# EAGLE design Easycheck_rev2_motherboard (EAGLE 9.4.0)
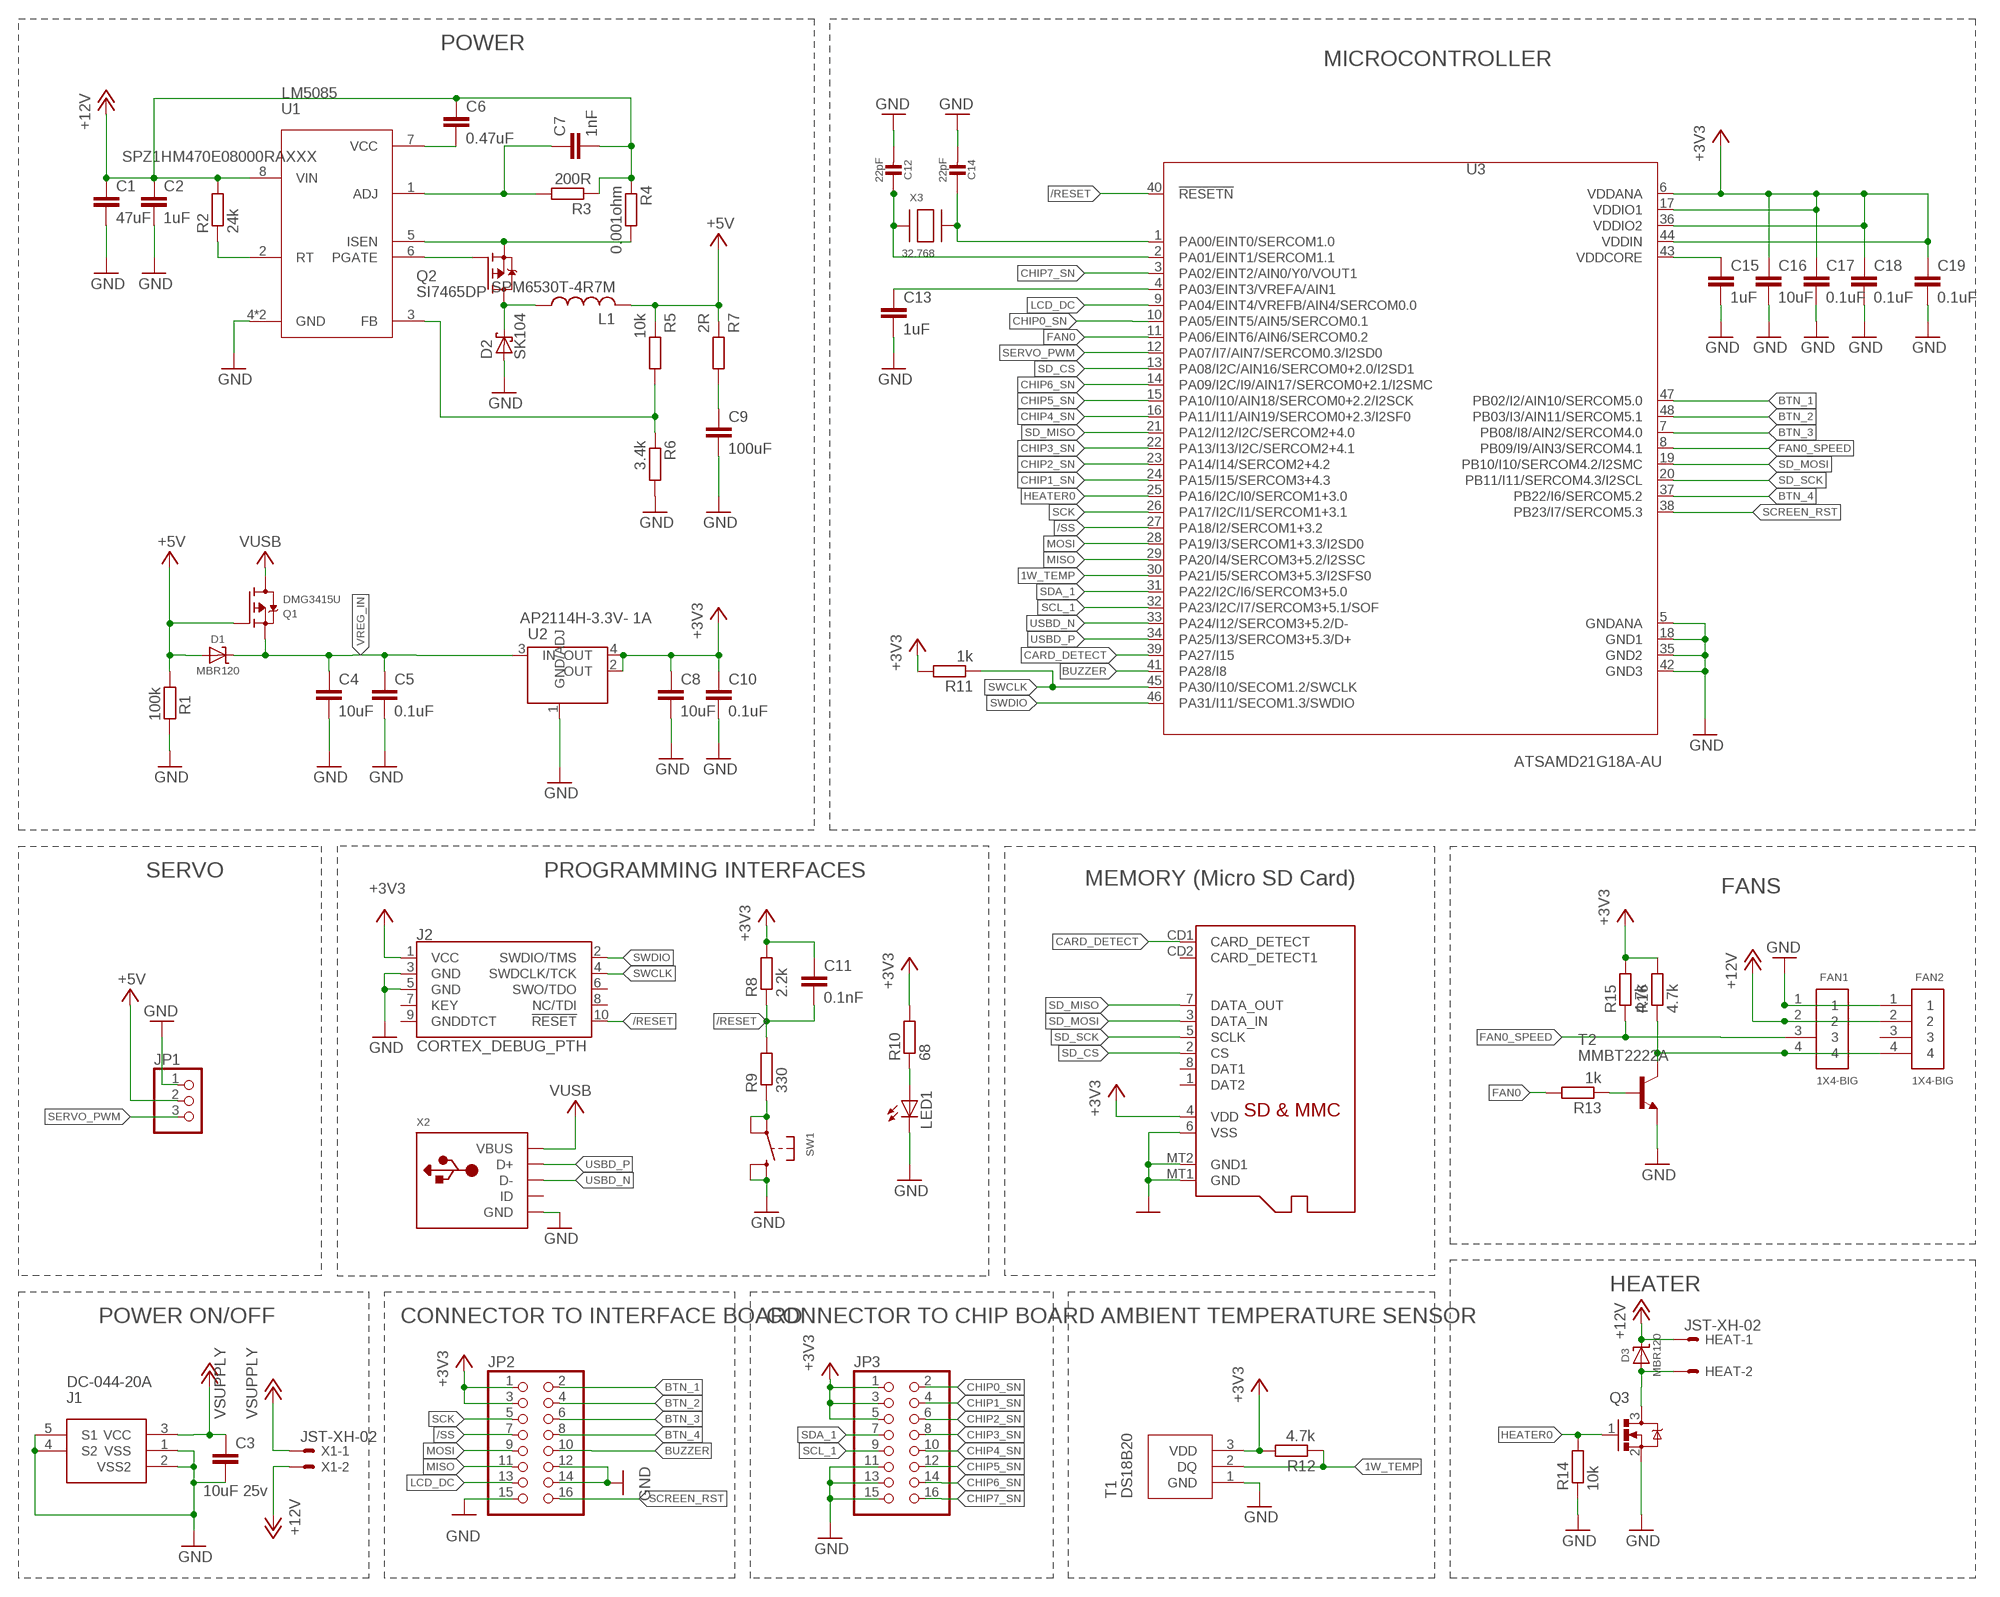
[diagram p0: schematic, sheet 1]

## Parts
C1  47uF  C-EUC1206  [C1206]
C2  1uF  C-EUC1206  [C1206]
C3  10uF 25v  C-EUC1206  [C1206]
C4  10uF  C-EUC0603  [C0603]
C5  0.1uF  C-EUC0603  [C0603]
C6  0.47uF  C-EUC1206  [C1206]
C7  1nF  C-EUC0603  [C0603]
C8  10uF  C-EUC0603  [C0603]
C9  100uF  C-EUC0805  [C0805]
C10  0.1uF  C-EUC0603  [C0603]
C11  0.1nF  C-EUC0603  [C0603]
C12  22pF  CAP_CERAMIC0603_NO  [0603-NO@1]
C13  1uF  C-EUC0603  [C0603]
C14  22pF  CAP_CERAMIC0603_NO  [0603-NO@1]
C15  1uF  C-EUC0603  [C0603]
C16  10uF  C-EUC0603  [C0603]
C17  0.1uF  C-EUC0603  [C0603]
C18  0.1uF  C-EUC0603  [C0603]
C19  0.1uF  C-EUC0603  [C0603]
D1  MBR120  MICROBUILDER_DIODE-SCHOTTKYSOD-123  [MICROBUILDER_SOD-123]
D2  SK104  [SK104]
D3  MBR120  MICROBUILDER_DIODE-SCHOTTKYSOD-123  [MICROBUILDER_SOD-123]
FAN1  1X4-BIG  [1X04-BIG]
FAN2  1X4-BIG  [1X04-BIG]
HEAT  JST-XH-02  JST-XH-02-PIN-LONG-PAD  [JST-XH-02-PACKAGE-LONG-PAD]
J1  DC-044-20A  [DC-044-20A]
J2  CORTEX_DEBUG_PTH  [2X5-PTH-1.27MM]
JP1  PINHD-1X3  [1X03]
JP2  PINHD-2X8  [2X08]
JP3  PINHD-2X8  [2X08]
L1  SPM6530T-4R7M  [SPM6530T-4R7M]
LED1  LEDCHIPLED_0603  [CHIPLED_0603]
Q1  DMG3415U  MOSFET-P  [SOT23-R]
Q2  SI7465DP  [SI7465]
Q3  DMN6140L  [SOT91P240X110-3N]
R1  100k  R-EU_R0603  [R0603]
R2  24k  R-EU_R0603  [R0603]
R3  200R  R-EU_R0603  [R0603]
R4  0.001ohm  R-EU_R1206  [R1206]
R5  10k  R-EU_R0603  [R0603]
R6  3.4k  R-EU_R0603  [R0603]
R7  2R  R-EU_R0805  [R0805]
R8  2.2k  R-EU_R0603  [R0603]
R9  330  R-EU_R0603  [R0603]
R10  68  R-EU_R0603  [R0603]
R11  1k  R-EU_R0603  [R0603]
R12  4.7k  R-EU_R0603  [R0603]
R13  1k  R-EU_R0603  [R0603]
R14  10k  R-EU_R0603  [R0603]
R15  4.7k  R-EU_R0603  [R0603]
R16  4.7k  R-EU_R0603  [R0603]
SD1  MICROSD  [MICROSD]
SW1  MICROBUILDER_SWITCH_TACT_SMT_EVQQ2_SMALL  [MICROBUILDER_EVQ-Q2_SMALLER]
T1  DS18B20  [TO92]
T2  MMBT2222A  MMBT2222ALT1-NPN-SOT23-BEC  [SOT23-BEC]
U1  LM5085  [LM5085]
U2  AP2114H-3.3V- 1A  GEN_COMP_LINEAR_MC33269ST  [GEN_COMP_SOT223]
U3  ATSAMD21G18A-AU  [QFP50P900X900X120-48N]
X1  JST-XH-02  JST-XH-02-PIN-LONG-PAD  [JST-XH-02-PACKAGE-LONG-PAD]
X2  MICROBUILDER_USB_MICRO_20329_V2  [MICROBUILDER_4UCONN_20329_V2]
X3  32.768  XTAL-3.2X1.5  [XTAL3215]

## Nets
1W_TEMP: R12.1 T1.2(DQ) U3.30(PA21/I5/SERCOM3+5.3/I2SFS0)
+3V3: C8.1 C10.1 C11.1 C16.1 C17.1 C18.1 C19.1 J2.1(VCC) JP2.1 JP2.3 JP3.1 JP3.3 JP3.5 R8.2 R10.2 R11.2 R12.2 R15.2 R16.2 SD1.4(VDD) T1.3(VDD) U2.2(OUT) U2.4(OUT) U3.6(VDDANA) U3.17(VDDIO1) U3.36(VDDIO2) U3.44(VDDIN)
+5V: D1.A JP1.2 L1.2 Q1.1(G) R1.1 R5.1 R7.1
+12V: C1.1 C2.1 C6.1 C7.2 D3.C FAN1.2 FAN2.2 HEAT.1 R2.2 R3.1 R4.1 U1.8(VIN) X1.2
/RESET: C11.2 J2.10(!RESET) R8.1 R9.2 U3.40(!RESETN)
/SS: JP2.7 U3.27(PA18/I2/SERCOM1+3.2)
BTN_1: JP2.2 U3.47(PB02/I2/AIN10/SERCOM5.0)
BTN_2: JP2.4 U3.48(PB03/I3/AIN11/SERCOM5.1)
BTN_3: JP2.6 U3.7(PB08/I8/AIN2/SERCOM4.0)
BTN_4: JP2.8 U3.37(PB22/I6/SERCOM5.2)
BUZZER: JP2.10 U3.41(PA28/I8)
CARD_DETECT: SD1.CD1(CARD_DETECT) U3.39(PA27/I15)
CHIP0_SN: JP3.2 U3.10(PA05/EINT5/AIN5/SERCOM0.1)
CHIP1_SN: JP3.4 U3.24(PA15/I15/SERCOM3+4.3)
CHIP2_SN: JP3.6 U3.23(PA14/I14/SERCOM2+4.2)
CHIP3_SN: JP3.8 U3.22(PA13/I13/I2C/SERCOM2+4.1)
CHIP4_SN: JP3.10 U3.16(PA11/I11/AIN19/SERCOM0+2.3/I2SF0)
CHIP5_SN: JP3.12 U3.15(PA10/I10/AIN18/SERCOM0+2.2/I2SCK)
CHIP6_SN: JP3.14 U3.14(PA09/I2C/I9/AIN17/SERCOM0+2.1/I2SMC)
CHIP7_SN: JP3.16 U3.3(PA02/EINT2/AIN0/Y0/VOUT1)
FAN0: R13.2 U3.11(PA06/EINT6/AIN6/SERCOM0.2)
FAN0_SPEED: FAN1.3 R15.1 U3.8(PB09/I9/AIN3/SERCOM4.1)
GND: C1.2 C2.2 C3.2 C4.2 C5.2 C8.2 C9.2 C10.2 C12.2 C13.2 C14.2 C15.2 C16.2 C17.2 C18.2 C19.2 D2.1(A) FAN1.1 FAN2.1 J1.1(VSS) J1.2(VSS2) J1.4(S2) J1.5(S1) J2.3(GND) J2.5(GND) JP1.1 JP2.12 JP2.14 JP2.15 JP3.11 JP3.13 JP3.15 LED1.C Q3.2 R1.2 R6.2 R14.1 SD1.6(VSS) SD1.MT1(GND) SD1.MT2(GND1) SW1.B'(S1) SW1.B(S) T1.1(GND) T2.E U1.4(GND) U1.9(GND) U2.1(GND/ADJ) U3.5(GNDANA) U3.18(GND1) U3.35(GND2) U3.42(GND3) X2.BASE@1(GND) X2.BASE@2(GND) X2.GND X2.SPRT@1(GND) X2.SPRT@2(GND) X2.SPRT@3(GND) X2.SPRT@4(GND)
HEATER0: Q3.1 R14.2 U3.25(PA16/I2C/I0/SERCOM1+3.0)
LCD_DC: JP2.13 U3.9(PA04/EINT4/VREFB/AIN4/SERCOM0.0)
MISO: JP2.11 U3.29(PA20/I4/SERCOM3+5.2/I2SSC)
MOSI: JP2.9 U3.28(PA19/I3/SERCOM1+3.3/I2SD0)
N$1: C9.1 R7.2
N$2: FAN1.4 FAN2.4 R16.1 T2.C
N$3: R13.1 T2.B
N$4: D3.A HEAT.2 Q3.3
N$8: R9.1 SW1.A'(P1) SW1.A(P)
N$13: C12.1 U3.2(PA01/EINT1/SERCOM1.1) X3.P$1
N$14: C14.1 U3.1(PA00/EINT0/SERCOM1.0) X3.P$2
N$15: C13.1 U3.4(PA03/EINT3/VREFA/AIN1)
N$16: C15.1 U3.43(VDDCORE)
N$17: LED1.A R10.1
N$27: R2.1 U1.2(RT)
N$39: Q2.1(S) Q2.2(S) Q2.3(S) R4.2 U1.5(ISEN)
N$41: C7.1 R3.2 U1.1(ADJ)
N$43: R5.2 R6.1 U1.3(FB)
N$46: C6.2 U1.7(VCC)
N$50: D2.2(C) L1.1 Q2.5(D) Q2.6(D) Q2.7(D) Q2.8(D) Q2.9(D)
N$51: Q2.4(G) U1.6(PGATE)
SCK: JP2.5 U3.26(PA17/I2C/I1/SERCOM1+3.1)
SCL_1: JP3.9 U3.32(PA23/I2C/I7/SERCOM3+5.1/SOF)
SCREEN_RST: JP2.16 U3.38(PB23/I7/SERCOM5.3)
SD_CS: SD1.2(CS) U3.13(PA08/I2C/AIN16/SERCOM0+2.0/I2SD1)
SD_MISO: SD1.7(DATA_OUT) U3.21(PA12/I12/I2C/SERCOM2+4.0)
SD_MOSI: SD1.3(DATA_IN) U3.19(PB10/I10/SERCOM4.2/I2SMC)
SD_SCK: SD1.5(SCLK) U3.20(PB11/I11/SERCOM4.3/I2SCL)
SDA_1: JP3.7 U3.31(PA22/I2C/I6/SERCOM3+5.0)
SERVO_PWM: JP1.3 U3.12(PA07/I7/AIN7/SERCOM0.3/I2SD0)
SWCLK: J2.4(SWDCLK/TCK) R11.1 U3.45(PA30/I10/SECOM1.2/SWCLK)
SWDIO: J2.2(SWDIO/TMS) U3.46(PA31/I11/SECOM1.3/SWDIO)
USBD_N: U3.33(PA24/I12/SERCOM3+5.2/D-) X2.D-
USBD_P: U3.34(PA25/I13/SERCOM3+5.3/D+) X2.D+
VREG_IN: C4.1 C5.1 D1.C Q1.2(S) U2.3(IN)
VSUPPLY: C3.1 J1.3(VCC) X1.1
VUSB: Q1.3(D) X2.VBUS
Unconnected: FAN2.3 J2.6(SWO/TDO) J2.7(KEY) J2.8(NC/TDI) J2.9(GNDDTCT) SD1.1(DAT2) SD1.8(DAT1) SD1.CD2(CARD_DETECT1) X2.ID

## Notes on the sheet
- POWER
- MICROCONTROLLER
- SPZ1HM470E08000RAXXX
- SERVO | PROGRAMMING INTERFACES
- MEMORY (Micro SD Card)
- FANS
- HEATER
- POWER ON/OFF | CONNECTOR TO INTERFACE BOARD | CONNECTOR TO CHIP BOARD | AMBIENT TEMPERATURE SENSOR

## Library data of the parts
C1-C11 C13 C15-C19 = rcl:C-EU: CAPACITOR, European symbol; SPICEPREFIX: C
C12 C14 = microbuilder:CAP_CERAMIC: Ceramic Capacitors For new designs, use the packages preceded by an '_' character since they are more reliable: The following footprints should be used on most boards: _0402 - Standard footprint for regular board layouts _0603 - Standard footprint for regular board layouts _0805 - Standard footprint for regular board layouts _1206 - Standard footprint for regular board layouts For extremely tight-pitch boards where space is at a premium, the following 'micro-pitch' footprints can be used (smaller pads, no silkscreen outline, etc.): _0402MP - Micro-pitch footprint for very dense/compact boards _0603MP - Micro-pitch footprint for very dense/compact boards _0805MP - Micro-pitch footprint for very dense/compact boards _1206MP - Micro-pitch footprint for very dense/compact boards
D1 D3 = Adafruit Feather M0 Basic rev C:MICROBUILDER_DIODE-SCHOTTKY
D2 = Neptune_custom_lib:SK104
FAN1 FAN2 = adafruit:1X4: 4-pin connector
HEAT X1 = con-jst-xh:JST-XH-02-PIN: JST XH Connector 2 Pin Wire to board connector. Pitch: 2,54 mm, (0.100") Number of pins: 2 Created by Rembrandt Electronics www.rembrandtelectronics.com
J1 = EasyCheck:DC-044-20A
J2 = SparkFun-Connectors:CORTEX_DEBUG: Cortex Debug Connector - 10 pin Supports JTAG debug, Serial Wire debug, and Serial Wire Viewer. PTH and SMD connector options available. General Connector Information <http://infocenter.arm.com/help/topic/com.arm.doc.faqs/attached/13634/cortex_debug_connectors.pdf> Products: PTH Connector <http://www.digikey.com/product-detail/en/cnc-tech/3220-10-0100-00/1175-1627-ND/3883661> -via Digi-Key SparkFun PSoc <https://www.sparkfun.com/products/13229> SparkFun T <https://www.sparkfun.com/products/13810>
JP1 = adafruit:PINHD-1X3: PIN HEADER
JP2 JP3 = pinhead:PINHD-2X8: PIN HEADER
L1 = Neptune_custom_lib:SPM6530T-4R7M
LED1 = led:LED: LED OSRAM: - CHIPLED LG R971, LG N971, LY N971, LG Q971, LY Q971, LO R971, LY R971 LH N974, LH R974 LS Q976, LO Q976, LY Q976 LO Q996 - Hyper CHIPLED LW Q18S LB Q993, LB Q99A, LB R99A - SideLED LS A670, LO A670, LY A670, LG A670, LP A670 LB A673, LV A673, LT A673, LW A673 LH A674 LY A675 LS A676, LA A676, LO A676, LY A676, LW A676 LS A679, LY A679, LG A679 - Hyper Micro SIDELED® LS Y876, LA Y876, LO Y876, LY Y876 LT Y87S - SmartLED LW L88C, LW L88S LB L89C, LB L89S, LG L890 LS L89K, LO L89K, LY L89K LS L896, LA L896, LO L896, LY L896 - TOPLED LS T670, LO T670, LY T670, LG T670, LP T670 LSG T670, LSP T670, LSY T670, LOP T670, LYG T670 LG T671, LOG T671, LSG T671 LB T673, LV T673, LT T673, LW T673 LH T674 LS T676, LA T676, LO T676, LY T676, LB T676, LH T676, LSB T676, LW T676 LB T67C, LV T67C, LT T67C, LS T67K, LO T67K, LY T67K, LW E67C LS E67B, LA E67B, LO E67B, LY E67B, LB E67C, LV E67C, LT E67C LW T67C LS T679, LY T679, LG T679 LS T770, LO T770, LY T770, LG T770, LP T770 LB T773, LV T773, LT T773, LW T773 LH T774 LS E675, LA E675, LY E675, LS T675 LS T776, LA T776, LO T776, LY T776, LB T776 LHGB T686 LT T68C, LB T68C - Hyper Mini TOPLED® LB M676 - Mini TOPLED Santana® LG M470 LS M47K, LO M47K, LY M47K Source: http://www.osram.convergy.de LUXEON: - LUMILED® LXK2-PW12-R00, LXK2-PW12-S00, LXK2-PW14-U00, LXK2-PW14-V00 LXK2-PM12-R00, LXK2-PM12-S00, LXK2-PM14-U00 LXK2-PE12-Q00, LXK2-PE12-R00, LXK2-PE12-S00, LXK2-PE14-T00, LXK2-PE14-U00 LXK2-PB12-K00, LXK2-PB12-L00, LXK2-PB12-M00, LXK2-PB14-N00, LXK2-PB14-P00, LXK2-PB14-Q00 LXK2-PR12-L00, LXK2-PR12-M00, LXK2-PR14-Q00, LXK2-PR14-R00 LXK2-PD12-Q00, LXK2-PD12-R00, LXK2-PD12-S00 LXK2-PH12-R00, LXK2-PH12-S00 LXK2-PL12-P00, LXK2-PL12-Q00, LXK2-PL12-R00 Source: www.luxeon.com KINGBRIGHT: KA-3528ASYC Source: www.kingbright.com
Q1 = microbuilder:MOSFET-P: P-Channel Mosfet LEGEND VDS: Voltage Drain-Source ID: Drain Current RDS(ON): Drain-Source On-State Resistance VGS(TH): Gate-Source Threshold Voltage CISS: Drain-Source Input Capacitance SOT-23 Name VDS ID RDS(ON) VGS(TH) CISS Order Number IRLML5103 30V 760mA 600 mOhm -- 75pF @ 25V Digikey: IRLML5103PBFCT-ND IRLML6401 12V 4.3A 50 mOhm 950mV @ 250µA 830pF @ 10V Digikey: IRLML6401PBFTR-ND NTR0202PL 20V 400mA 800 mOhm 2.3V @ 250uA 70pF @ 5V Digikey: NTR0202PLT1GOSTR-ND NTR4101PT1G 20V 1.8A 85 mOhm 1.2V @ 250uA 675pF @ 10V Digikey: NTR4101PT1GOSCT-ND DMP2004K 20V 600mA 900 mOhm 1V @ 250uA 175pF @ 16V Digikey: DMP2004KDICT-ND PMV65XP 20V 3.9A 76 mOhm 950mV @ 1mA 725pF @ 20V Digikey: 568-2358-2-ND TO-252 Name VDS ID RDS(ON) VGS(TH) CISS Order Number AOD417 30V 25A 34 mOhm 3V @ 250µA 920pF @ 15V Digikey: 785-1106-2-ND PowerPak Name VDS ID RDS(ON) VGS(TH) CISS Order Number AON7401 30V 12A 14 mOhm 3V @ 250µA 2600pF @ 15V Digikey: 785-1302-1-ND
Q2 = Neptune_custom_lib:SI7465DP
Q3 = DMN6140L:DMN6140L
R1-R16 = rcl:R-EU_: RESISTOR, European symbol; SPICEPREFIX: R
SD1 = adafruit:MICROSD: Micro-SD / Transflash card holder with SPI pinout For the 3M # 2908-05WB-MG and/or 4UCON #19656 push-push type
SW1 = Adafruit HUZZAH32 ESP32 Feather:MICROBUILDER_SWITCH_TACT_SMT: SMT Tact Switches 6x6mm - Digikey: P12940SCT-ND KMR2 (4.6x2.8mm) - Digikey: 401-1426-1-ND EVQ-PQHB55 - Light Touch, 160GF (4.5x4.5mm) - Digikey: P8090SCT-ND KMT0 - KMT021 NGJ LHS (etc.) IP68/Waterproof - Digikey: CKN10289CT-ND
T1 = Smart_socket:DS18B20
T2 = transistor:*-NPN-: NPN Transistror BF959 corrected 2008.03.06
U1 = Neptune_custom_lib:LM5085
U2 = Arduino_Micro:GEN_COMP_LINEAR_MC33269ST*: Adjustable Output Low Dropout Voltage Regulator 800 mA Source: http://www.onsemi.com/pub/Collateral/MC33269-D.PDF
U3 = ATSAMD21G18A-AU:ATSAMD21G18A-AU: Cortex-M0+, 256KB FLASH, 32KB SRAM, USB, DMA, T&R - 48TQFP IND TEMP, GREEN, 1.6-3.6V, 48MHz; AVAILABILITY: Unavailable; DESCRIPTION: SAMD21G Series 256 kB Flash 32 kB SRAM 48 MHz 32-Bit Microcontroller - TQFP-48; MF: Microchip; MP: ATSAMD21G18A-AU; PACKAGE: TQFP-48 Microchip; PRICE: None
X2 = Adafruit ESP8266 Feather rev E:MICROBUILDER_USB: USB Connectors USBMINIB - Surface Mount Female Mini-B USB Connector 4UConnector: 06564
X3 = adafruit2:XTAL: Low cost SMT crystals, no capacitors included http://www.ladyada.net/library/eagle

## Board
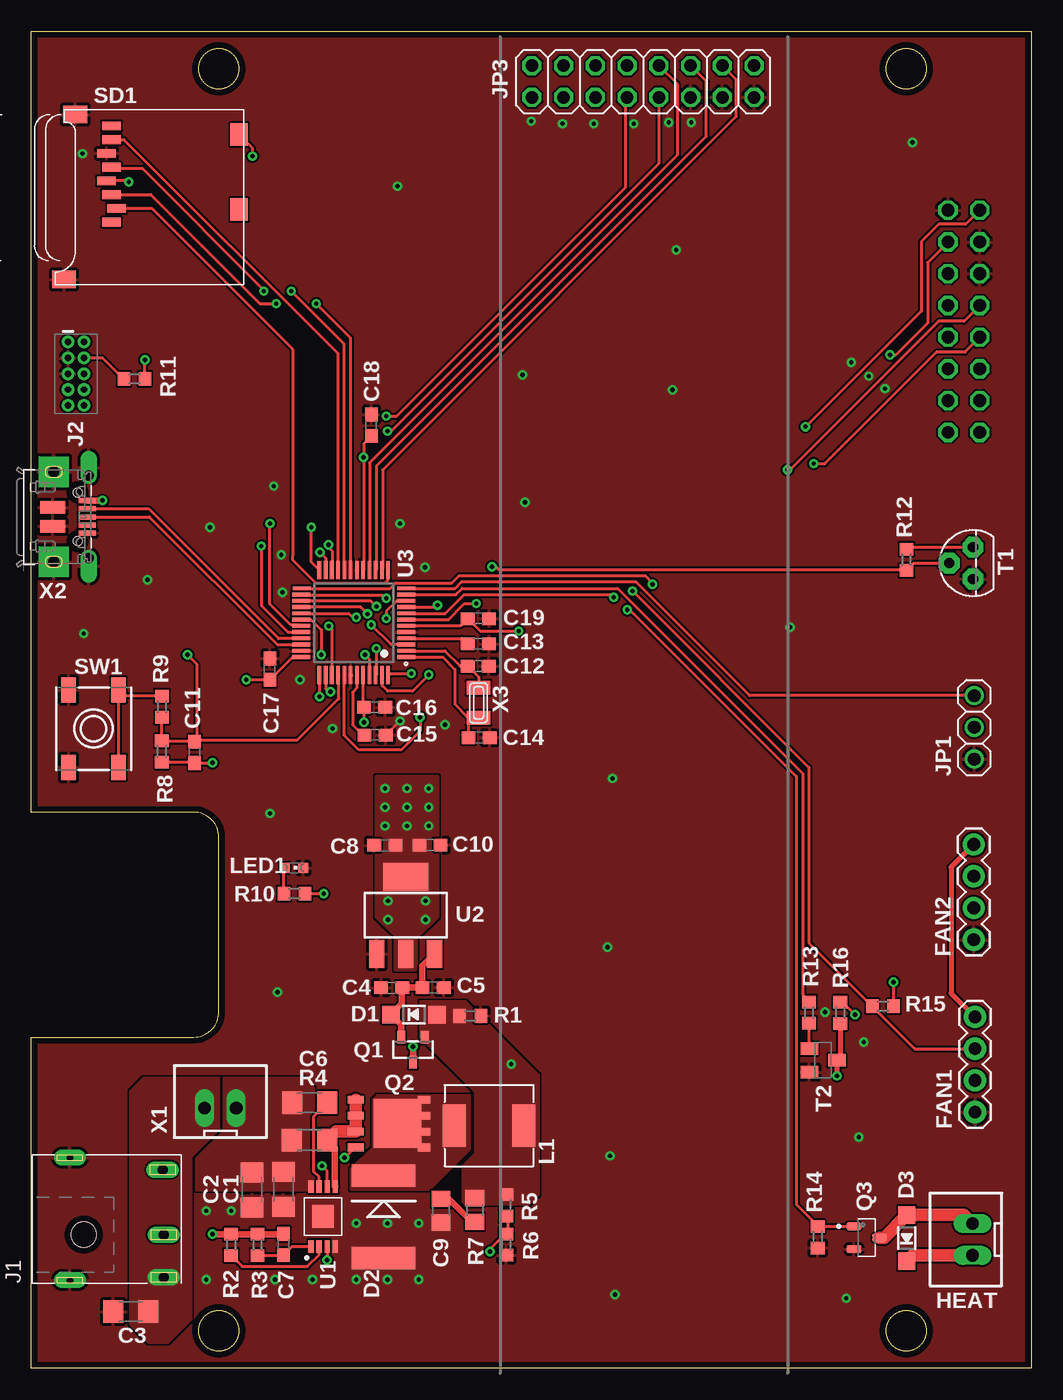
[diagram p1: board, top side]
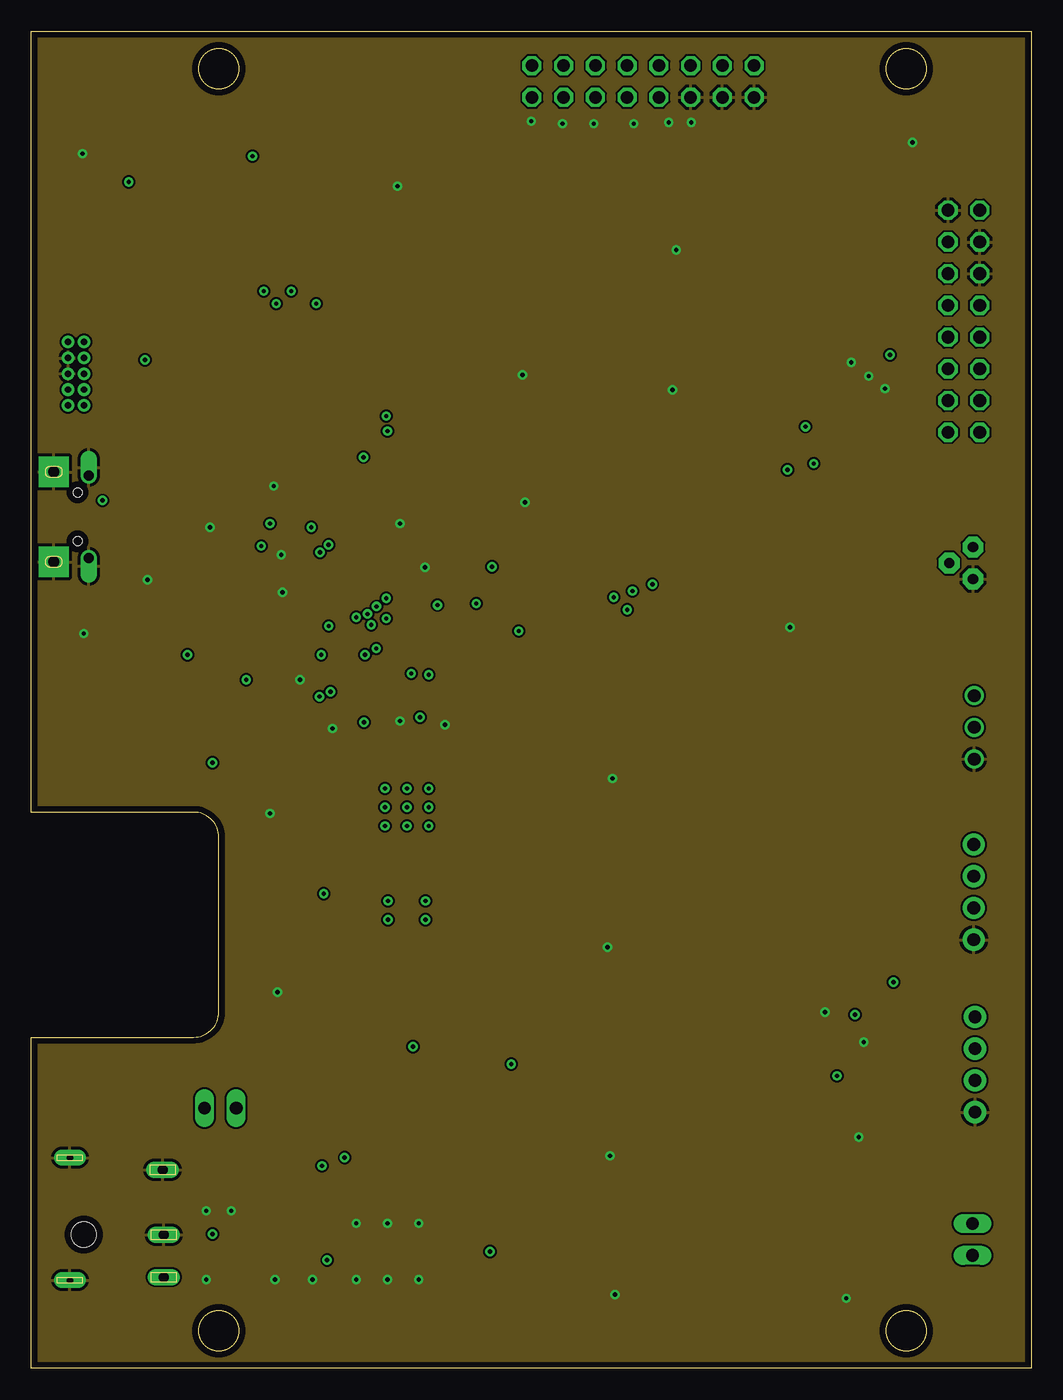
[diagram p2: board, inner layer Layer2]
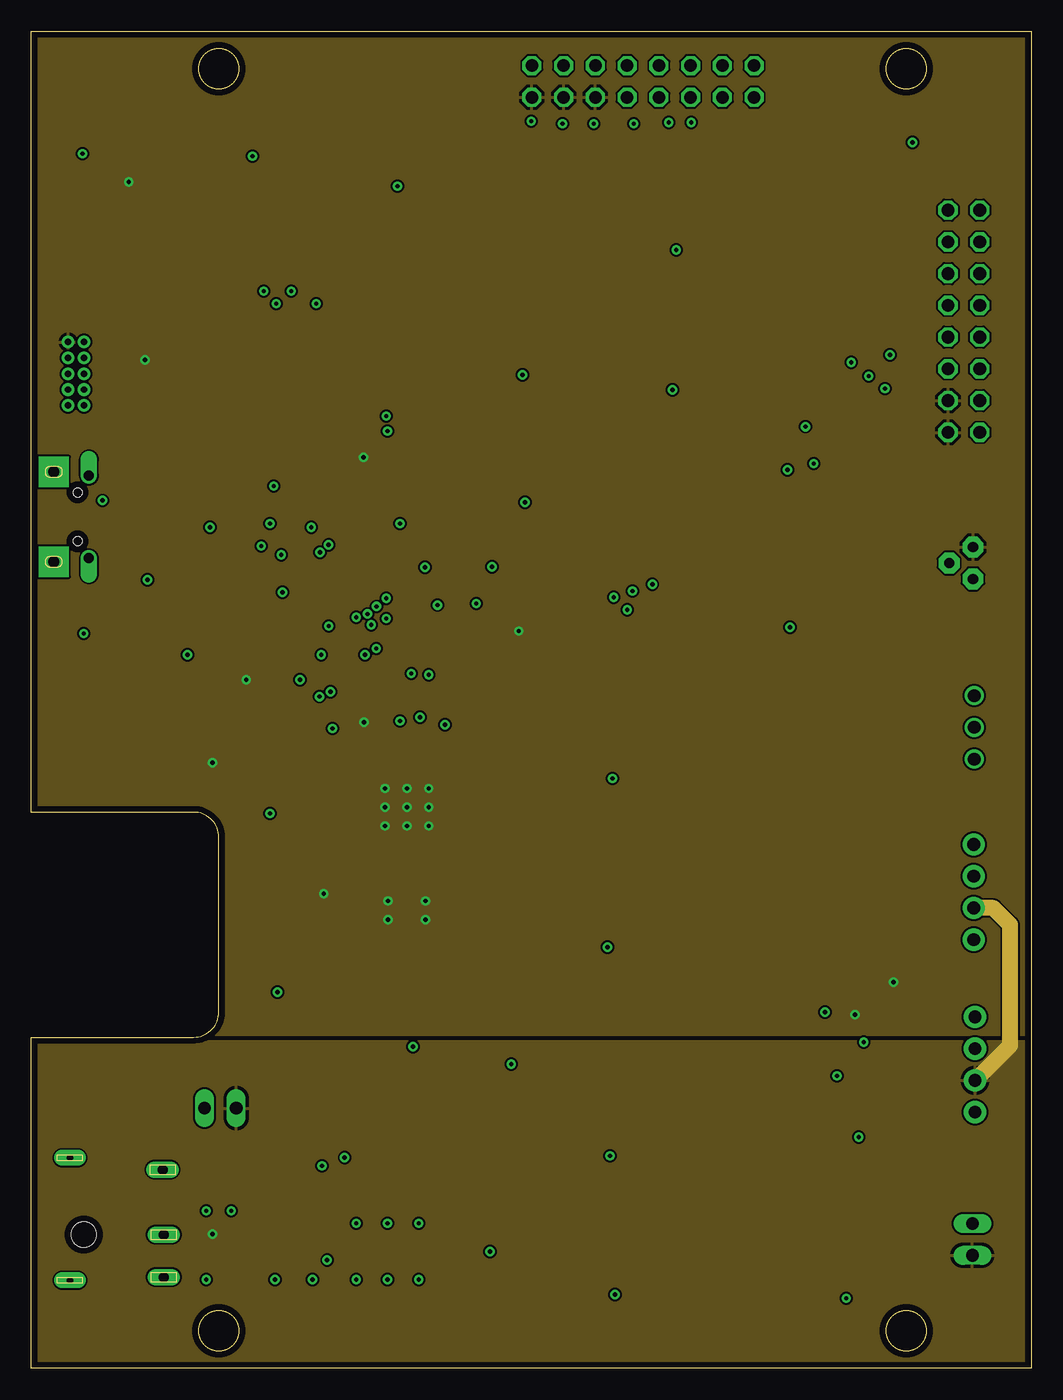
[diagram p3: board, inner layer Layer3]
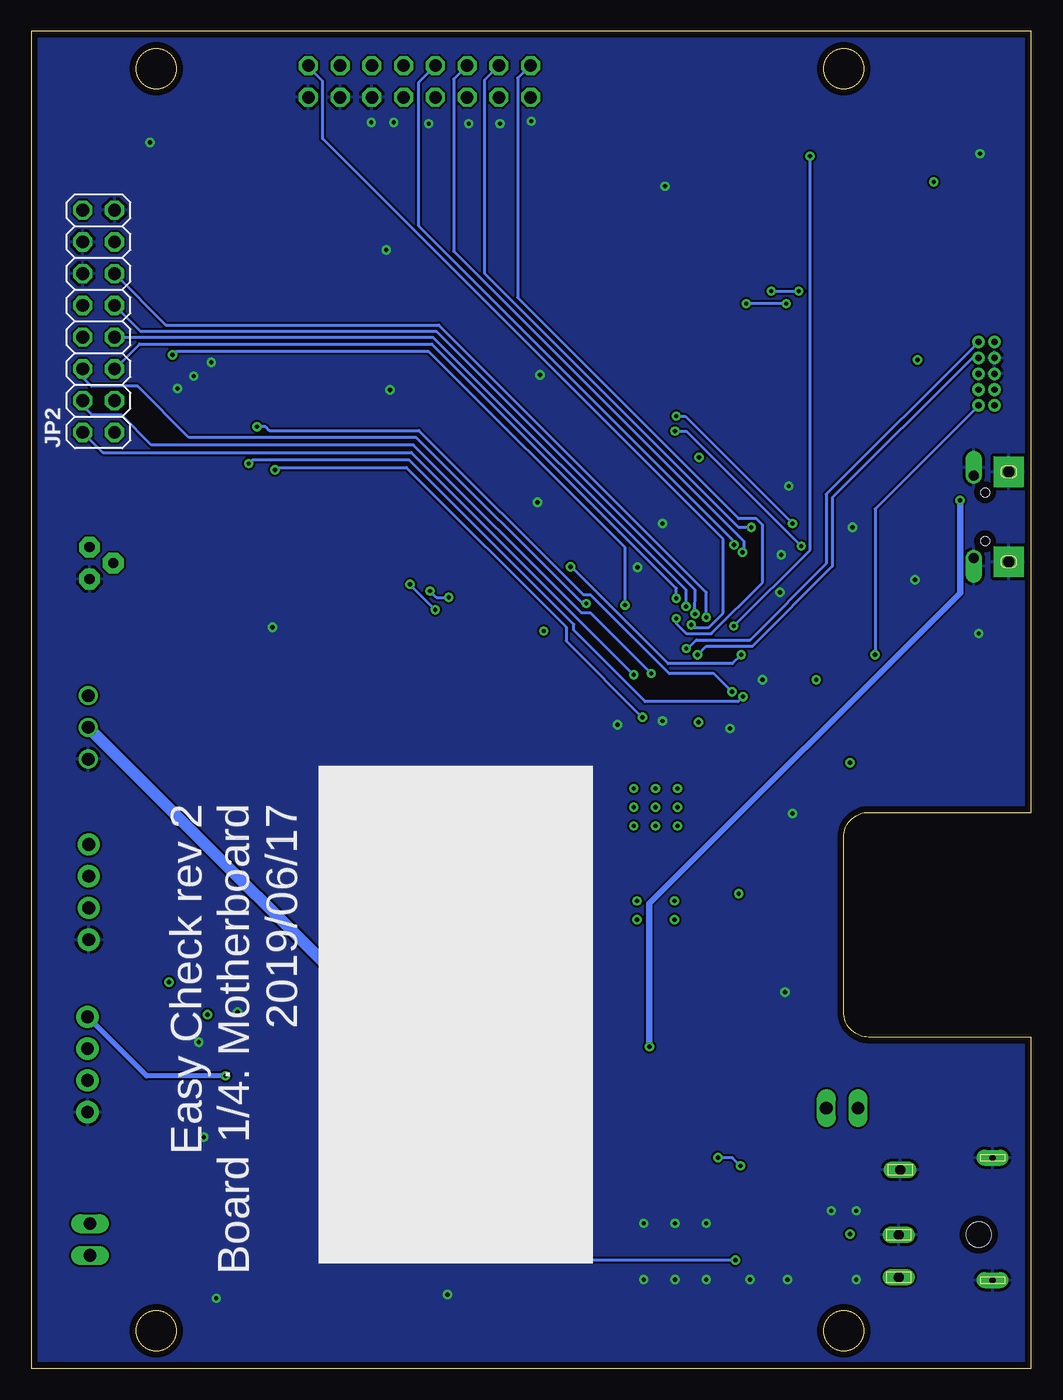
[diagram p4: board, bottom side, seen from below]

Size 80 x 107 mm. Coordinates in mm from the lower left corner, seen from the top.
Outline: 80,0 0,0
Outline: 0,0 0,26.5
Outline: 0,26.5 13,26.5
Outline: 13,26.5 arc90 15,28.5
Outline: 15,28.5 15,42.5
Outline: 15,42.5 arc90 13,44.5
Outline: 13,44.5 0,44.5
Outline: 0,44.5 0,107
Outline: 0,107 80,107
Outline: 80,0 0,0
Outline: 0,0 0,26.5
Outline: 0,26.5 13,26.5
Outline: 13,26.5 arc90 15,28.5
Outline: 15,28.5 15,42.5
Outline: 15,42.5 arc90 13,44.5
Outline: 13,44.5 0,44.5
Outline: 0,44.5 0,107
Outline: 0,107 80,107
Outline: 80,107 80,0
Outline: 0,4.8 0,14.3
Outline: circle at 15,104 radius 1.6
Outline: circle at 15,3 radius 1.6
Outline: circle at 70,3 radius 1.6
Outline: circle at 70,104 radius 1.6
Outline: circle at 15,104 radius 1.6
Outline: circle at 15,3 radius 1.6
Outline: circle at 70,3 radius 1.6
Outline: circle at 70,104 radius 1.6
Copper layers (1+2*15+16): Top 0.035mm / dielectric 0.2mm / Layer2 0.035mm / dielectric 1.05mm / Layer3 0.035mm / dielectric 0.2mm / Bottom 0.035mm
Design rules "default *": minimum track width 6mil, minimum drill 0.35mm, track to track 6mil, track to pad 6mil, pad to pad 6mil, via to via 6mil, smd to smd 6mil, copper to edge 20mil, drill to drill 6mil, minimum pad ring 10mil, minimum via ring 8mil, stop-mask expansion 4mil, vias tented up to drill 0.4mm, thermal gap 10mil

### Footprints (pad centres in the part's own frame; a part is rotated, then mirrored left to right if it is on the bottom)
C1206 = smd 1.6 x 1.8: 1 -1.4,0; 2 1.4,0
C0603 = smd 1.1 x 1: 1 -0.85,0; 2 0.85,0
C0805 = smd 1.3 x 1.5: 1 -0.95,0; 2 0.95,0
0603-NO@1 = smd 1.1 x 1: 1 -0.85,0; 2 0.85,0
MICROBUILDER_SOD-123 = smd 1.4 x 1.4: A 1.85,0; C -1.85,0
SK104 = smd 1.778 x 5.08: 1 -3.302,0; 2 3.302,0
1X04-BIG = drill 1.016 pad 1.778: 1 0,0; 2 2.54,0; 3 5.08,0; 4 7.62,0
JST-XH-02-PACKAGE-LONG-PAD = drill 1.016 long: 1 -1.27,0; 2 1.27,0
DC-044-20A = drill 0.8 pad 1.27 long: 1 5.2,0.1; 2 0,0; 3 -3.4,0 | drill 0.5 pad 1.27 long: 4 -3.65,7.5; 5 6.15,7.5 | hole 2: 0,6.4
2X5-PTH-1.27MM = drill 0.508 pad 1: 1 -2.54,-0.635; 2 -2.54,0.635; 3 -1.27,-0.635; 4 -1.27,0.635; 5 0,-0.635; 6 0,0.635; 7 1.27,-0.635; 8 1.27,0.635; 9 2.54,-0.635; 10 2.54,0.635
1X03 = drill 1.016: 1 -2.54,0; 2 0,0; 3 2.54,0
2X08 = drill 1.016 octagon: 1 -8.89,-1.27; 2 -8.89,1.27; 3 -6.35,-1.27; 4 -6.35,1.27; 5 -3.81,-1.27; 6 -3.81,1.27; 7 -1.27,-1.27; 8 -1.27,1.27; 9 1.27,-1.27; 10 1.27,1.27; 11 3.81,-1.27; 12 3.81,1.27; 13 6.35,-1.27; 14 6.35,1.27; 15 8.89,-1.27; 16 8.89,1.27
SPM6530T-4R7M = smd 1.85 x 3.4: 1 -2.775,0; 2 2.775,0
CHIPLED_0603 = smd 0.8 x 0.8: A 0,-0.75; C 0,0.75
SOT23-R = smd 0.635 x 1.016: 1 -0.95,-1; 2 0.95,-1; 3 0,1
SI7465 = smd 1.27 x 0.61: 1 0,1.905; 2 0,0.635; 3 0,-0.635; 4 0,-1.905 | smd 1.02 x 0.61: 5 5.465,-1.905; 6 5.465,-0.635; 7 5.465,0.635; 8 5.465,1.905 | smd 3.81 x 3.91: 9 3.36,0
SOT91P240X110-3N = smd 1.18 x 0.61: 1 -1.025,0.915; 2 -1.025,-0.915; 3 1.025,0
R0603 = smd 1 x 1.1: 1 -0.85,0; 2 0.85,0
R1206 = smd 1.6 x 1.803: 1 -1.422,0; 2 1.422,0
R0805 = smd 1.3 x 1.5: 1 -0.95,0; 2 0.95,0
MICROSD = smd 0.7 x 1.5: 1 9,-10.64; 2 7.9,-10.24; 3 6.8,-10.64; 4 5.7,-11.04; 5 4.6,-10.64; 6 3.5,-11.04; 7 2.4,-10.64; 8 1.3,-10.64 | smd 1.8 x 1.4: CD1 2,-0.44; CD2 8,-0.44 | smd 1.4 x 1.9: MT1 0.4,-13.54; MT2 13.6,-14.44
MICROBUILDER_EVQ-Q2_SMALLER = smd 2 x 1.2: A -3.1,-2; A' 3.1,-2; B -3.1,2; B' 3.1,2
TO92 = drill 0.813 pad 1.676 octagon: 1 -1.27,0; 2 0,1.905; 3 1.27,0
SOT23-BEC = smd 1 x 1.4: B -0.95,-1.1; C 0,1.1; E 0.95,-1.1
LM5085 = smd 0.41 x 1.02: 1 -0.975,-2.4; 2 -0.325,-2.4; 3 0.325,-2.4; 4 0.975,-2.4; 5 0.975,2.4; 6 0.325,2.4; 7 -0.325,2.4; 8 -0.975,2.4 | smd 1.73 x 1.85: 9 0,0
GEN_COMP_SOT223 = smd 1.219 x 2.235: 1 -2.311,-3.099; 2 0,-3.099; 3 2.311,-3.099 | smd 3.6 x 2.2: 4 0,3.099
QFP50P900X900X120-48N = smd 1.45 x 0.3: 1 -4.2,2.75; 2 -4.2,2.25; 3 -4.2,1.75; 4 -4.2,1.25; 5 -4.2,0.75; 6 -4.2,0.25; 7 -4.2,-0.25; 8 -4.2,-0.75; 9 -4.2,-1.25; 10 -4.2,-1.75; 11 -4.2,-2.25; 12 -4.2,-2.75; 25 4.17,-2.75; 26 4.2,-2.25; 27 4.2,-1.75; 28 4.2,-1.25; 29 4.2,-0.75; 30 4.2,-0.25; 31 4.2,0.25; 32 4.2,0.75; 33 4.2,1.25; 34 4.2,1.75; 35 4.2,2.25; 36 4.2,2.75 | smd 0.3 x 1.45: 13 -2.75,-4.2; 14 -2.25,-4.2; 15 -1.75,-4.2; 16 -1.25,-4.2; 17 -0.75,-4.2; 18 -0.25,-4.2; 19 0.25,-4.2; 20 0.75,-4.2; 21 1.25,-4.2; 22 1.75,-4.2; 23 2.25,-4.2; 24 2.75,-4.2; 37 2.75,4.2; 38 2.25,4.2; 39 1.75,4.2; 40 1.25,4.2; 41 0.75,4.2; 42 0.25,4.2; 43 -0.25,4.2; 44 -0.75,4.2; 45 -1.25,4.2; 46 -1.75,4.2; 47 -2.25,4.2; 48 -2.75,4.2
MICROBUILDER_4UCONN_20329_V2 = smd 1 x 2: BASE@1 -0.75,-2; BASE@2 0.75,-2 | smd 0.4 x 1.35: D+ 0,0.775; D- -0.65,0.775; GND 1.3,0.775; ID 0.65,0.775; VBUS -1.3,0.775 | drill 0.8 pad 1.143 offset: SPRT@1 -3.3,0.9; SPRT@2 3.3,0.9 | drill 0.9 pad 2.413 square: SPRT@3 -3.6,-1.9; SPRT@4 3.6,-1.9 | hole 0.7: -1.95,0; 1.95,0
XTAL3215 = smd 1.1 x 1.9: P$1 1.2,0; P$2 -1.2,0

### Placement (x,y rotation side)
C1  20.17,14.31 270 top
C2  17.67,14.29 270 top
C3  7.97,4.53 180 top
C4  28.83,30.45 180 top
C5  32.15,30.47 0 top
C6  22.26,21.27 0 top
C7  20.19,9.91 90 top
C8  28.28,41.85 180 top
C9  32.77,12.61 270 top
C10  31.9,41.87 0 top
C11  13.08,49.3 90 top
C12  35.76,56.19 0 top
C13  35.77,57.98 0 top
C14  35.82,50.47 0 top
C15  27.51,50.68 0 top
C16  27.47,52.9 0 top
C17  19.08,55.95 90 top
C18  27.2,75.47 90 top
C19  35.77,60 0 top
D1  30.62,28.31 0 top
D2  28.18,12.12 90 top
D3  70.04,10.42 90 top
FAN1  75.5,20.5 90 top
FAN2  75.4,34.3 90 top
HEAT  75.29,10.31 90 top
J1  10.6,10.7 90 top
J2  3.58,79.59 270 top
JP1  75.44,51.29 90 top
JP2  74.61,83.79 90 bottom
JP3  48.94,102.98 0 top
L1  36.61,19.42 0 top
LED1  21.02,40.06 270 top
Q1  30.54,25.49 180 top
Q2  25.95,19.59 0 top
Q3  66.84,10.45 0 top
R1  35.12,28.2 0 top
R2  15.99,9.88 90 top
R3  18.1,9.88 270 top
R4  22.26,18.25 0 top
R5  38.01,13.05 270 top
R6  38,9.91 270 top
R7  35.47,12.67 270 top
R8  10.43,49.37 270 top
R9  10.46,52.94 270 top
R10  21.05,37.99 0 top
R11  8.25,79.18 0 top
R12  70.02,64.71 90 top
R13  62.22,28.47 90 top
R14  62.92,10.49 90 top
R15  68.13,28.98 0 top
R16  64.72,28.45 90 top
SD1  17.06,100.73 270 top
SW1  4.98,51.19 90 top
T1  75.34,64.44 90 top
T2  63.35,24.65 270 top
U1  23.35,12.15 0 top
U2  29.95,36.25 0 top
U3  25.8,59.67 180 top
X1  15.13,20.82 0 top
X2  3.7,68.14 270 top
X3  35.78,53.26 90 top

### Tracks (layer width: path | path; a pad name or v marks a point on that pad's centre or on a via)
1W_TEMP  (via drill 0.35)
  Top 0.254: U3.30 21.62,59.9 22.39,59.9 23.2,59.09 v23.2,57.1 | v36.85,64.15 37.15,64.15 37.4,63.9 69.98,63.9 R12.1 70.6,64.44 T1.2
  Bottom 0.254: v23.2,57.1 23.9,56.4 29.05,56.4 36.8,64.15 v36.85,64.15
+3V3  (via drill 0.35)
  Top 0.254: U3.44 26.52,55.44 26.52,53 C16.1 v26.62,51.71 | U3.6 34.34,59.42 C19.1 35.92,59 v39,59 | C18.1 26.6,74.02 26.6,73.4 26.6,73.2 | 26.6,73.2 26.6,63.92 U3.17 | R12.2 70.17,65.71 T1.3 | v7.8,94.93 7.7,95.03 SD1.4 | U3.36 20.9,56.92 C17.1 v17.2,55.1 | R8.2 13.01,48.52 C11.1 v14.5,48.45 | v65.9,28.3 64.81,29.39 R16.2 | R15.2 v68.98,30.9 | R10.2 v23.4,37.99 | R11.2 v9.1,80.7 | 26.6,73.2 26.6,72.93 v26.59,72.91
  other vias: 28.3,43.4 31.8,43.4 30.05,44.9 31.8,44.9 28.3,44.9 30.05,43.4 31.8,46.4 28.3,46.4 30.05,46.4 28.55,37.4 31.55,37.4 28.55,35.9 31.55,35.9
  pour Top (no thermals): 27.6,36.1 27.6,47.4 32.5,47.4 32.5,36.1 30.8,34.4 30.8,31.95 30.7,31.85 29.1,31.85 29.1,34.6
  pour Layer3: -1.9,108.9 -1.9,26.7 80.6,26.7 80.6,108.9
+5V  (via drill 0.35)
  Bottom 1.016: JP1.2 48.5,24.35 v38.4,24.35
  pour Top (no thermals): 31.1,29.4 34.7,29.4 40.6,23.5 40.6,13.9 39.8,13.1 34.7,13.1 34.5,13.3 34.5,16.2 35.5,17.2 35.5,22.1 31.1,26.5
+12V  (via drill 0.35)
  Top 0.508: C7.2 20.16,10.73 R3.1 R2.2 v14.5,10.73
  Top 1.016: D3.C 70.51,9.04 HEAT.1
  Layer3 1.27: FAN1.2 78.3,25.84 78.3,35.5 76.96,36.84 FAN2.2
  pour Top (no thermals): 15.4,23.3 21.8,23.3 22.6,22.5 22.6,14.2 13.2,14.2 13.2,16.8 15.4,19
  pour Layer3: -0.3,26.2 80.7,26.2 80.7,-0.5 -0.3,-0.5
/RESET  (via drill 0.35)
  Top 0.254: R9.2 10.43,52.06 R8.1 10.5,50.15 C11.2 13.23,50.3 | 13.23,50.3 21.3,50.3 24.6,53.6 24.6,55.42 U3.40 | v12.5,57.1 13.23,56.37 13.23,50.3
  Bottom 0.254: J2.10 12.5,68.77 v12.5,57.1
/SS  (via drill 0.35)
  Top 0.254: v27.61,60.96 27.16,61.42 U3.27
  Bottom 0.254: v27.61,60.96 27.61,62.26 47.85,82.5 73.32,82.5 JP2.7
BTN_1  (via drill 0.35)
  Top 0.254: v31.8,55.5 30.5,54.2 28.5,54.2 28.1,54.6 28.05,54.65 U3.47
  Bottom 0.254: JP2.2 74.28,73.3 49.6,73.3 v31.8,55.5
BTN_2  (via drill 0.35)
  Top 0.254: U3.48 28.68,55.6 v30.4,55.6
  Bottom 0.254: v30.4,55.6 35.24,60.44 35.97,60.44 49.43,73.9 70.4,73.9 72.76,76.26 75.14,76.26 75.98,77.11 75.98,77.34 JP2.4
BTN_3  (via drill 0.35)
  Top 0.254: U3.7 30.03,59.89 33.34,59.89 34.65,61.2 v35.6,61.2
  Bottom 0.254: v35.6,61.2 35.9,61.2 49.2,74.5 67.4,74.5 71.5,78.6 75.2,78.6 75.88,79.28 JP2.6
BTN_4  (via drill 0.35)
  Top 0.254: U3.37 v23.05,53.76 | JP2.8 74.68,81.32 72.41,81.32 63.49,72.4 v62.6,72.4
  Bottom 0.254: v23.05,53.76 23.45,53.36 30.88,53.36 36.6,59.07 36.6,59.52 49.78,72.7 62.3,72.7 v62.6,72.4
BUZZER  (via drill 0.35)
  Top 0.254: JP2.10 74.62,83.8 72.6,83.8 60.6,71.8 v60.5,71.9 | v31.1,52.1 31.1,51 29.6,49.5 26.2,49.5 25.05,50.65 U3.41
  Bottom 0.254: v60.5,71.9 60.3,72.1 50,72.1 37.21,59.31 37.21,58.2 v31.1,52.1
CARD_DETECT  (via drill 0.35)
  Top 0.254: v23.8,59.4 24.05,59.15 U3.39 | v17.7,97 17.7,97.65 SD1.CD1
  Bottom 0.254: v23.8,59.4 17.7,65.5 v17.7,97
CHIP0_SN  (via drill 0.35)
  Top 0.254: U3.10 29.22,61.42 28.4,60.6 v28.4,60
  Bottom 0.254: JP3.2 40.08,104.25 41.09,103.24 41.09,85.69 23.4,68 22,68 21.5,67.5 21.5,62.9 25.6,58.8 27.6,58.8 28.4,59.6 v28.4,60
CHIP1_SN  (via drill 0.35)
  Top 0.254: U3.24 22.4,64.52 v22.4,67.3
  Bottom 0.254: v22.4,67.3 23.4,67.3 43.7,87.6 43.7,103.14 JP3.4
CHIP2_SN  (via drill 0.35)
  Top 0.254: v23.1,65.3 23.55,64.85 U3.23
  Bottom 0.254: JP3.6 46.18,103.2 46.2,103.2 46.2,89.38 23,66.18 23,65.4 v23.1,65.3
CHIP3_SN  (via drill 0.35)
  Top 0.254: U3.22 24.08,63.9 24.08,65.41 23.79,65.7 v23.79,65.9
  Bottom 0.254: v23.79,65.9 23.79,66.2 49,91.41 49,102.92 JP3.8
CHIP4_SN
  Top 0.254: U3.16 27.08,63.9 27.08,72.48 51.71,97.11 51.71,102.75 JP3.10
CHIP5_SN
  Top 0.254: U3.15 27.6,63.92 27.6,72.2 54,98.6 54,103 JP3.12
CHIP6_SN
  Top 0.254: U3.14 28.05,63.97 28.1,64.02 28.1,71.9 56.4,100.2 56.4,103.14 JP3.14
CHIP7_SN  (via drill 0.35)
  Top 0.254: U3.3 28.78,57.92 v27.2,59.5
  Bottom 0.254: v27.2,59.5 27,59.3 25.8,59.3 24.65,60.45 24.65,66.35 56.69,98.39 56.69,103.01 57.83,104.15 JP3.16
FAN0
  Top 0.254: U3.11 33.48,61.92 33.98,61.92 34.47,62.41 46.91,62.41 61.71,47.62 61.71,29.93 62.22,29.42 R13.2
FAN0_SPEED  (via drill 0.35)
  Top 0.254: R15.1 67.68,28.58 | 67.68,28.58 70.68,25.58 FAN1.3 | v46.6,61.7 46.4,61.9 34.6,61.9 33.12,60.42 U3.8 | v48.1,62.2 62.21,48.09 62.21,34.05 67.68,28.58
  Bottom 0.254: v46.6,61.7 47.6,61.7 v48.1,62.2
GND  (via drill 0.35)
  Top 0.254: C15.2 29.48,51.8 v29.5,51.8
  other vias: 14,12.6 16,12.6 14,7.1 19.5,7.1 22.5,7.1 26,7.1 26,11.6 28.5,11.6 31,11.6 28.5,7.1 31,7.1 21.5,55.1 20,65.1 29.5,67.6 31.5,64.1 19.4,70.6 20.1,62.1 14.3,67.3 9.3,63.1 4.2,58.8 4.1,97.2 29.3,94.6 40,99.8 42.5,99.6 45,99.6 48.2,99.6 51,99.7 52.8,99.7 68.3,78.4 67,79.4 65.6,80.5 24.1,51.2 33.1,51.5 46.5,47.2 46.1,33.7 46.3,17 46.7,5.9 60.7,59.3 51.3,78.3 39.5,69.3 39.3,79.5 51.6,89.5 70.5,98.1 65.2,5.6 66.2,18.5 66.6,26.1 63.5,28.5 19.7,30.1 19.1,44.4
  pour Bottom: -3.4,110.2 -3.4,-3.7 82.1,-3.7 82.1,110.2
  pour Top (rank 2): -3.1,110 -3.1,-4 81.7,-4 81.7,110
  pour Layer2: -2.6,109.5 -2.6,-2.9 80.6,-2.9 80.6,109.5
  pour Top (no thermals): 13.2,13.8 13.2,6.5 34.1,6.5 34.1,13.8
HEATER0  (via drill 0.35)
  Top 0.254: R14.2 62.95,11.37 | 62.95,11.37 Q3.1 | U3.25 28.73,62.42 29.16,62.85 33.65,62.85 34.23,63.43 49.1,63.43 49.69,62.84 v49.69,62.74 | v47.68,60.69 47.88,60.69 61.2,47.37 61.2,13.11 62.95,11.37
  Bottom 0.254: v49.69,62.74 49.69,62.7 v47.68,60.69
LCD_DC  (via drill 0.35)
  Top 0.254: JP2.13 71.7,88.5 71.7,83.65 69.15,81.1 v68.7,81.1 | U3.9 32.34,60.92 v32.5,61.08
  Bottom 0.254: v68.7,81.1 68.4,81.4 56.5,81.4 48.22,81.4 32.5,65.68 v32.5,61.08
MISO  (via drill 0.35)
  Top 0.254: U3.29 25.38,60.42 25.7,60.1 v26,60.1
  Bottom 0.254: v26,60.1 26,62.1 47.4,83.5 69.24,83.5 JP2.11
MOSI  (via drill 0.35)
  Top 0.254: v26.9,60.36 26.34,60.92 U3.28 22.37,60.92
  Bottom 0.254: JP2.9 71.28,83 47.6,83 26.9,62.3 v26.9,60.36 | v26.9,60.36
N$1
  Top 0.508: R7.2 35.23,11.72 33.4,13.56 C9.1
N$2  (via drill 0.35)
  Top 0.254: 64.72,24.92 T2.C
  Top 0.406: R16.1 64.72,24.92 | T2.C v64.45,23.4 | FAN2.4 73.6,40.12 73.6,30.02 FAN1.4
  Bottom 0.406: v64.45,23.4 70.78,23.4 FAN1.4
N$3
  Top 0.254: T2.B 62.22,25.63 R13.1
N$4
  Top 1.016: HEAT.2 74.59,12.28 D3.A 68.22,10.45 Q3.3
N$8
  Top 0.254: R9.1 7.48,53.79 7.08,54.19 | 7.08,54.19 SW1.A' | SW1.A 6.98,54.08 7.08,54.19
N$13
  Top 0.254: U3.2 33.08,57.42 34.31,56.19 C12.1 35.78,55.32 X3.P$1
N$14
  Top 0.254: U3.1 32.9,56.92 33.88,55.94 33.88,53.16 34.98,52.06 X3.P$2 35.18,52.06 34.97,51.85 C14.1
N$15
  Top 0.254: U3.4 34.48,58.42 C13.1
N$16
  Top 0.254: U3.43 26.05,54.45 25.7,54.1 25.7,51.5 26.52,50.68 C15.1
N$17
  Top 0.254: R10.1 20.2,39.99 LED1.A
N$27
  Top 0.254: R2.1 16.87,8.15 22.1,8.15 23.03,9.07 U1.2
N$39
  Top 0.508: U1.5 24.29,14.59 24.29,17.65 R4.2
  Top 1.016: R4.2 24.39,18.95 Q2.3 Q2.2 Q2.1
N$41
  Top 0.254: R3.2 18.13,9.06 C7.1 20.88,9.75 U1.1
N$43  (via drill 0.35)
  Top 0.254: R5.2 38.1,12.11 38.1,10.95 38,10.85 | 38,10.85 R6.1 | U1.3 v23.67,8.65 | v36.7,9.35 36.7,9.55 38,10.85
  Bottom 0.254: v23.67,8.65 36,8.65 v36.7,9.35
N$46
  Top 0.254: U1.7 23.03,15.31 22.6,15.73 22.6,20.16 23.66,21.22 C6.2
N$50
  pour Top (no thermals): 27.7,21.85 35.05,21.85 35.05,17.5 31.85,14.3 25.6,14.3 25.6,15.95 27.35,17.7 27.35,21.5
N$51  (via drill 0.35)
  Top 0.254: U1.6 23.67,15.8 23.28,16.2 v23.26,16.2 | v25.07,16.85 25.91,17.69 Q2.4
  Bottom 0.254: v23.26,16.2 23.91,16.85 v25.07,16.85
SCK  (via drill 0.35)
  Top 0.254: v28.4,61.62 28.33,61.62 28.1,61.85 21.67,61.85 U3.26
  Bottom 0.254: v28.4,61.62 28.4,62.42 47.96,81.98 71.34,81.98 JP2.5
SCL_1  (via drill 0.35)
  Top 0.254: JP3.9 50.21,96.41 28.8,75 v28.5,75 | U3.32 21.57,58.89 20.56,58.89 18.4,61.05 v18.4,65.8
  Bottom 0.254: v28.5,75 27.6,75 27.45,74.85 v18.4,65.8
SCREEN_RST  (via drill 0.35)
  Top 0.254: U3.38 23.55,54.4 23.8,54.15 v23.94,54.15 | JP2.16 74.75,91.55 72.6,91.55 71.2,90.15 71.2,84.6 v61.96,75.36 v61.95,75.36
  Bottom 0.254: v23.94,54.15 25.39,55.6 28.95,55.6 35.24,61.89 35.82,61.89 48.98,75.06 60.95,75.06 61.25,75.36 v61.95,75.36
SD_CS
  Top 0.254: SD1.2 9.62,92.83 20.9,81.55 20.9,65 20.9,64.7 22.77,62.83 28.28,62.83 28.48,63.03 | 28.55,63.1 28.48,63.03 | 28.48,63.03 28.55,63.1 | 28.55,63.1 U3.13
SD_MISO
  Top 0.254: U3.21 24.5,63.92 24.5,81.24 7.42,98.33 SD1.7
SD_MOSI  (via drill 0.35)
  Top 0.254: SD1.3 9.57,93.93 18.3,85.2 v19.6,85.2 | v22.8,85.2 25.5,82.5 25.5,63.92 U3.19
  Bottom 0.254: v19.6,85.2 v22.8,85.2
SD_SCK  (via drill 0.35)
  Top 0.254: U3.20 25,63.92 25,82 v20.8,86.2 | v18.6,86.2 18.6,86.3 8.9,96 6.55,96 SD1.5
  Bottom 0.254: v20.8,86.2 v18.6,86.2
SDA_1  (via drill 0.35)
  Top 0.254: JP3.7 47.5,101.54 47.5,94.47 29.23,76.2 v28.4,76.2 | U3.31 21.53,59.49 20.76,59.49 19.1,61.15 v19.1,67.6
  Bottom 0.254: v28.4,76.2 27.7,76.2 v19.1,67.6
SERVO_PWM
  Top 0.254: U3.12 33.9,62.42 34.4,62.92 48.38,62.92 57.47,53.83 JP1.3
SWCLK  (via drill 0.35)
  Top 0.254: v26.7,57.1 27.05,56.75 27.05,55.57 U3.45 | R11.1 5.72,80.86 J2.4
  Bottom 0.254: v26.7,57.1 26,57.8 22.3,57.8 15.9,64.2 15.9,69.67 4.71,80.86 J2.4
SWDIO  (via drill 0.35)
  Top 0.254: v27.6,57.6 27.6,55.52 U3.46
  Bottom 0.254: J2.2 16.4,69.94 16.4,64.4 22.5,58.3 26.8,58.3 27.5,57.6 v27.6,57.6
USBD_N
  Top 0.254: X2.D- 9.39,68.79 19.79,58.39 21.57,58.39 U3.33
USBD_P
  Top 0.254: X2.D+ 9.46,68.14 19.68,57.92 U3.34
VREG_IN
  Top 0.406: 29.65,30.42 C4.1
  Top 0.508: 29.65,30.42 29.65,29.19 D1.C 29.59,27.49 Q1.2 | C4.1 29.7,30.47 C5.1 31.3,32.19 U2.3
VSUPPLY
  pour Top (no thermals): 9,23.3 15,23.3 15,19.1 12.8,16.9 12.8,3.9 10.9,2 9.4,2 7.9,3.5 7.9,22.2
VUSB  (via drill 0.35)
  Top 0.254: X2.VBUS 5.6,69.45 v5.7,69.45
  Top 0.508: v30.55,25.75 Q1.3 | X2.VBUS 5.6,69.45
  Bottom 0.508: v30.55,25.75 30.55,37.2 5.7,62.05 v5.7,69.45

### Text on the board
bPlace: Easy Check rev 2 / Board 1/4: Motherboard / 2019/06/17